# EAGLE design T04_Display (EAGLE 6.3)
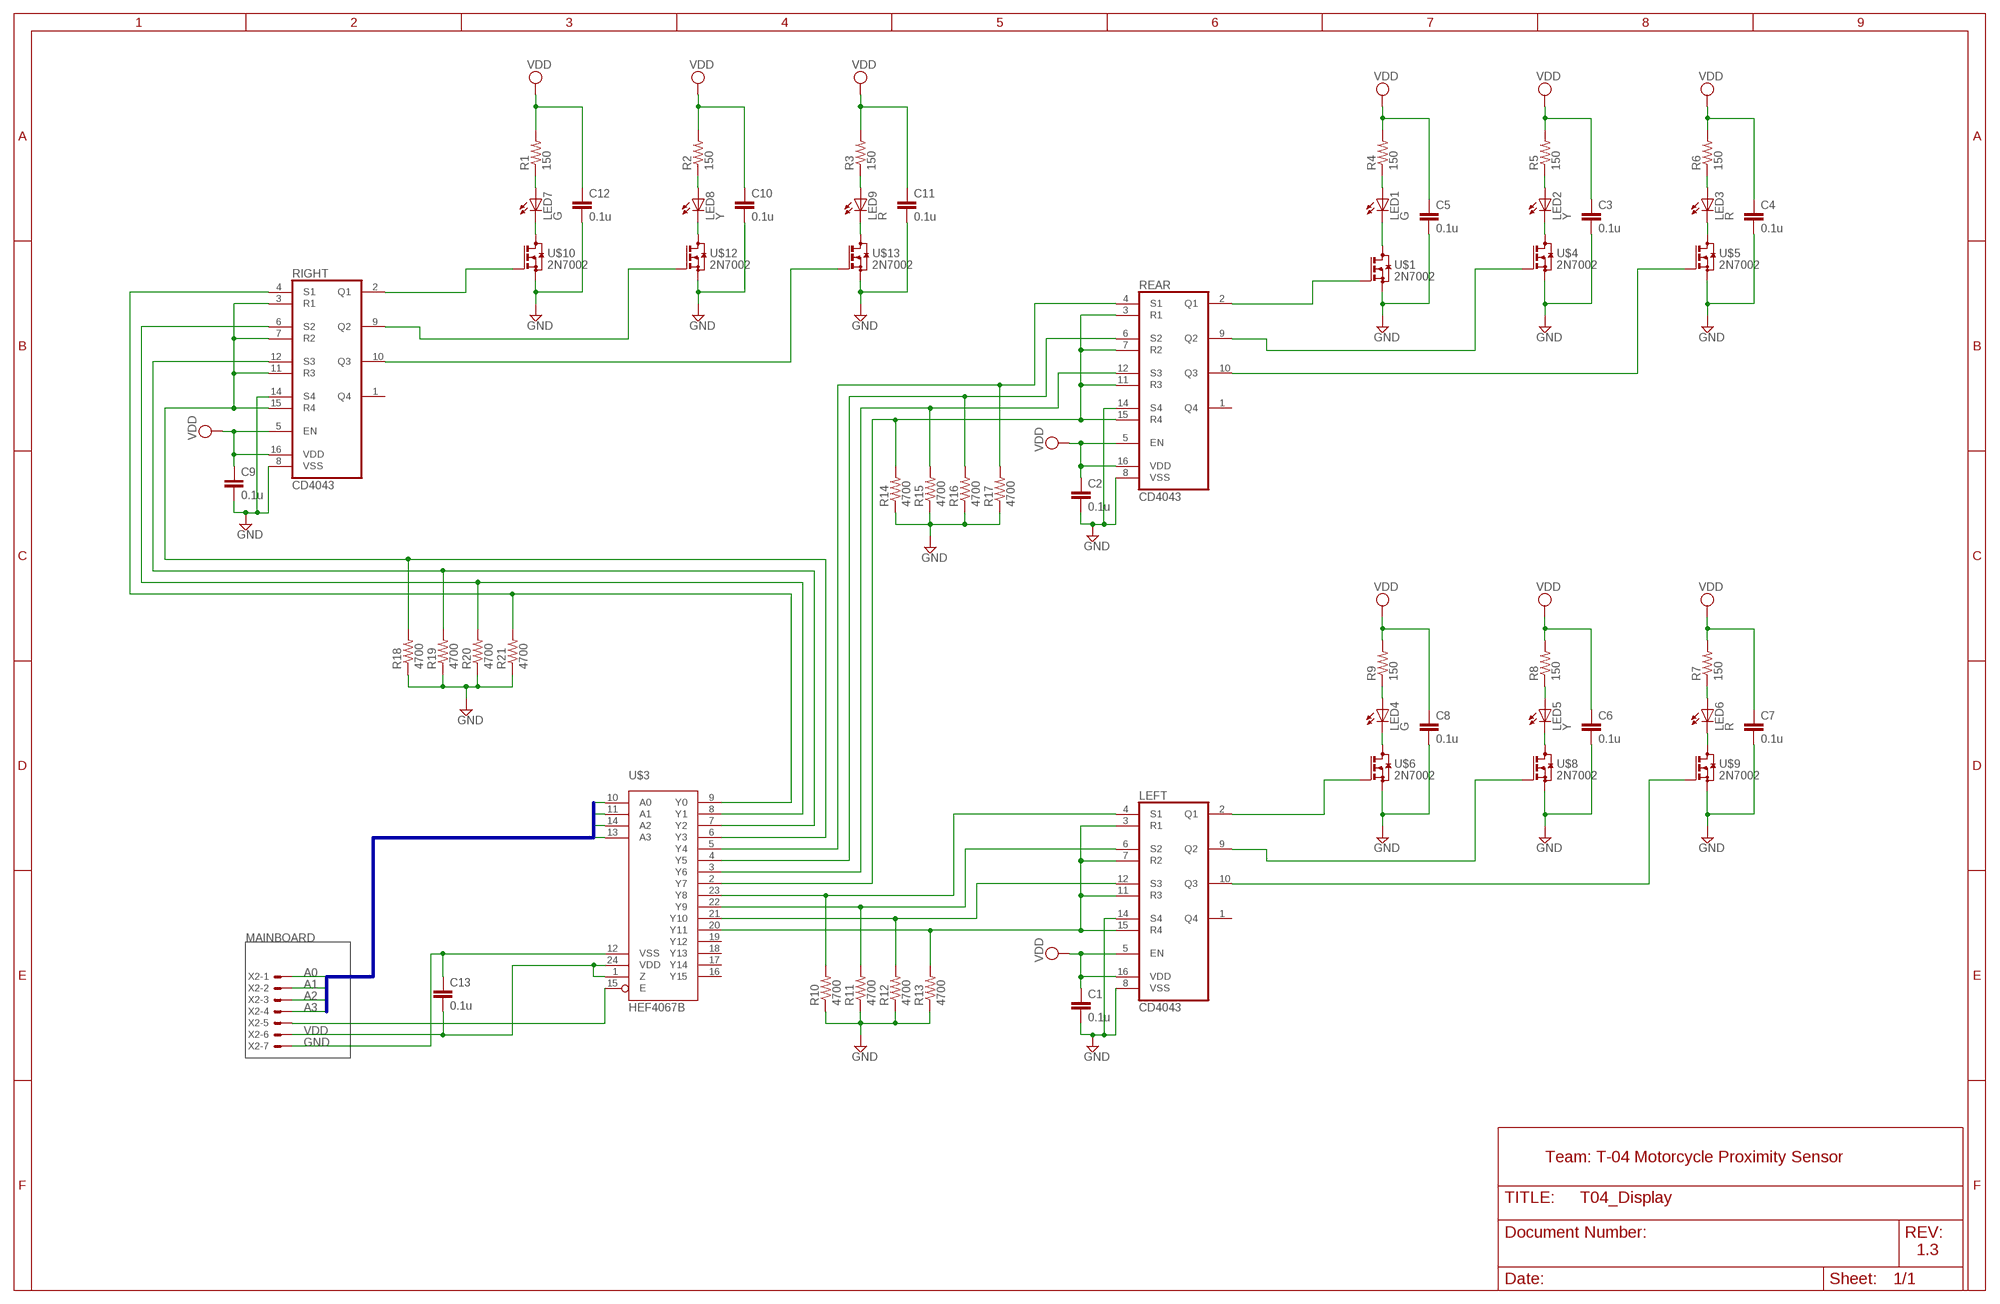
[diagram p0: schematic, sheet 1]

## Parts
C1  0.1u  C-EUC1206  [C1206]
C2  0.1u  C-EUC1206  [C1206]
C3  0.1u  C-EUC1206  [C1206]
C4  0.1u  C-EUC1206  [C1206]
C5  0.1u  C-EUC1206  [C1206]
C6  0.1u  C-EUC1206  [C1206]
C7  0.1u  C-EUC1206  [C1206]
C8  0.1u  C-EUC1206  [C1206]
C9  0.1u  C-EUC1206  [C1206]
C10  0.1u  C-EUC1206  [C1206]
C11  0.1u  C-EUC1206  [C1206]
C12  0.1u  C-EUC1206  [C1206]
C13  0.1u  C-EUC1206  [C1206]
LED1  G  LED3MM  [LED3MM]
LED2  Y  LED3MM  [LED3MM]
LED3  R  LED3MM  [LED3MM]
LED4  G  LED3MM  [LED3MM]
LED5  Y  LED3MM  [LED3MM]
LED6  R  LED3MM  [LED3MM]
LED7  G  LED3MM  [LED3MM]
LED8  Y  LED3MM  [LED3MM]
LED9  R  LED3MM  [LED3MM]
LEFT  CD4043  [SOIC16N]
R1  150  R-US_R1206  [R1206]
R2  150  R-US_R1206  [R1206]
R3  150  R-US_R1206  [R1206]
R4  150  R-US_R1206  [R1206]
R5  150  R-US_R1206  [R1206]
R6  150  R-US_R1206  [R1206]
R7  150  R-US_R1206  [R1206]
R8  150  R-US_R1206  [R1206]
R9  150  R-US_R1206  [R1206]
R10  4700  R-US_R1206  [R1206]
R11  4700  R-US_R1206  [R1206]
R12  4700  R-US_R1206  [R1206]
R13  4700  R-US_R1206  [R1206]
R14  4700  R-US_R1206  [R1206]
R15  4700  R-US_R1206  [R1206]
R16  4700  R-US_R1206  [R1206]
R17  4700  R-US_R1206  [R1206]
R18  4700  R-US_R1206  [R1206]
R19  4700  R-US_R1206  [R1206]
R20  4700  R-US_R1206  [R1206]
R21  4700  R-US_R1206  [R1206]
REAR  CD4043  [SOIC16N]
RIGHT  CD4043  [SOIC16N]
U$1  2N7002  [SOT23]
U$3  HEF4067B  [SO24W]
U$4  2N7002  [SOT23]
U$5  2N7002  [SOT23]
U$6  2N7002  [SOT23]
U$8  2N7002  [SOT23]
U$9  2N7002  [SOT23]
U$10  2N7002  [SOT23]
U$12  2N7002  [SOT23]
U$13  2N7002  [SOT23]
X2  22-23-2071  [22-23-2071]

## Nets
A0: U$3.10(A0) X2.1
A1: U$3.11(A1) X2.2
A2: U$3.14(A2) X2.3
A3: U$3.13(A3) X2.4
BG: RIGHT.2(Q1) U$10.1(G)
BR: RIGHT.10(Q3) U$13.1(G)
BRES: R18.2 RIGHT.3(R1) RIGHT.7(R2) RIGHT.11(R3) RIGHT.15(R4) U$3.6(Y3)
BS1: R21.2 RIGHT.4(S1) U$3.9(Y0)
BS2: R20.2 RIGHT.6(S2) U$3.8(Y1)
BS3: R19.2 RIGHT.12(S3) U$3.7(Y2)
BY: RIGHT.9(Q2) U$12.1(G)
GND: C1.2 C2.2 C3.2 C4.2 C5.2 C6.2 C7.2 C8.2 C9.2 C10.2 C11.2 C12.2 C13.1 LEFT.8(VSS) LEFT.14(S4) R10.1 R11.1 R12.1 R13.1 R14.1 R15.1 R16.1 R17.1 R18.1 R19.1 R20.1 R21.1 REAR.8(VSS) REAR.14(S4) RIGHT.8(VSS) RIGHT.14(S4) U$1.2(S) U$3.12(VSS) U$4.2(S) U$5.2(S) U$6.2(S) U$8.2(S) U$9.2(S) U$10.2(S) U$12.2(S) U$13.2(S) X2.7
LG: REAR.2(Q1) U$1.1(G)
LR: REAR.10(Q3) U$5.1(G)
LRES: R14.2 REAR.3(R1) REAR.7(R2) REAR.11(R3) REAR.15(R4) U$3.2(Y7)
LS1: R17.2 REAR.4(S1) U$3.5(Y4)
LS2: R16.2 REAR.6(S2) U$3.4(Y5)
LS3: R15.2 REAR.12(S3) U$3.3(Y6)
LY: REAR.9(Q2) U$4.1(G)
N$1: LED3.K(C) U$5.3(D)
N$3: LED2.K(C) U$4.3(D)
N$4: LED1.K(C) U$1.3(D)
N$5: LED1.A R4.1
N$6: LED3.A R6.1
N$7: U$3.15(E) X2.5
N$8: LED4.A R9.1
N$9: LED5.A R8.1
N$10: LED2.A R5.1
N$12: LED6.A R7.1
N$13: LED7.K(C) U$10.3(D)
N$14: LED7.A R1.1
N$15: LED8.K(C) U$12.3(D)
N$16: LED8.A R2.1
N$17: LED9.K(C) U$13.3(D)
N$18: LED9.A R3.1
N$21: LED6.K(C) U$9.3(D)
N$22: LED4.K(C) U$6.3(D)
N$23: LED5.K(C) U$8.3(D)
RG: LEFT.2(Q1) U$6.1(G)
RR: LEFT.10(Q3) U$9.1(G)
RRES: LEFT.3(R1) LEFT.7(R2) LEFT.11(R3) LEFT.15(R4) R13.2 U$3.20(Y11)
RS1: LEFT.4(S1) R10.2 U$3.23(Y8)
RS2: LEFT.6(S2) R11.2 U$3.22(Y9)
RS3: LEFT.12(S3) R12.2 U$3.21(Y10)
RY: LEFT.9(Q2) U$8.1(G)
VDD: C1.1 C2.1 C3.1 C4.1 C5.1 C6.1 C7.1 C8.1 C9.1 C10.1 C11.1 C12.1 C13.2 LEFT.5(EN) LEFT.16(VDD) R1.2 R2.2 R3.2 R4.2 R5.2 R6.2 R7.2 R8.2 R9.2 REAR.5(EN) REAR.16(VDD) RIGHT.5(EN) RIGHT.16(VDD) U$3.1(Z) U$3.24(VDD) X2.6
Unconnected: LEFT.1(Q4) REAR.1(Q4) RIGHT.1(Q4) U$3.16(Y15) U$3.17(Y14) U$3.18(Y13) U$3.19(Y12)

## Buses
A0,A1,A2,A3

## Notes on the sheet
- MAINBOARD
- Team: T-04 Motorcycle Proximity Sensor
- 1.3

## Library data of the parts
C1-C13 = resistor:C-EU: CAPACITOR, European symbol; SPICEPREFIX: C
LED1-LED9 = display:LED: LED OSRAM: - CHIPLED LG R971, LG N971, LY N971, LG Q971, LY Q971, LO R971, LY R971 LH N974, LH R974 LS Q976, LO Q976, LY Q976 LO Q996 - Hyper CHIPLED LW Q18S LB Q993, LB Q99A, LB R99A - SideLED LS A670, LO A670, LY A670, LG A670, LP A670 LB A673, LV A673, LT A673, LW A673 LH A674 LY A675 LS A676, LA A676, LO A676, LY A676, LW A676 LS A679, LY A679, LG A679 - Hyper Micro SIDELED® LS Y876, LA Y876, LO Y876, LY Y876 LT Y87S - SmartLED LW L88C, LW L88S LB L89C, LB L89S, LG L890 LS L89K, LO L89K, LY L89K LS L896, LA L896, LO L896, LY L896 - TOPLED LS T670, LO T670, LY T670, LG T670, LP T670 LSG T670, LSP T670, LSY T670, LOP T670, LYG T670 LG T671, LOG T671, LSG T671 LB T673, LV T673, LT T673, LW T673 LH T674 LS T676, LA T676, LO T676, LY T676, LB T676, LH T676, LSB T676, LW T676 LB T67C, LV T67C, LT T67C, LS T67K, LO T67K, LY T67K, LW E67C LS E67B, LA E67B, LO E67B, LY E67B, LB E67C, LV E67C, LT E67C LW T67C LS T679, LY T679, LG T679 LS T770, LO T770, LY T770, LG T770, LP T770 LB T773, LV T773, LT T773, LW T773 LH T774 LS E675, LA E675, LY E675, LS T675 LS T776, LA T776, LO T776, LY T776, LB T776 LHGB T686 LT T68C, LB T68C - Hyper Mini TOPLED® LB M676 - Mini TOPLED Santana® LG M470 LS M47K, LO M47K, LY M47K Source: http://www.osram.convergy.de LUXEON: - LUMILED® LXK2-PW12-R00, LXK2-PW12-S00, LXK2-PW14-U00, LXK2-PW14-V00 LXK2-PM12-R00, LXK2-PM12-S00, LXK2-PM14-U00 LXK2-PE12-Q00, LXK2-PE12-R00, LXK2-PE12-S00, LXK2-PE14-T00, LXK2-PE14-U00 LXK2-PB12-K00, LXK2-PB12-L00, LXK2-PB12-M00, LXK2-PB14-N00, LXK2-PB14-P00, LXK2-PB14-Q00 LXK2-PR12-L00, LXK2-PR12-M00, LXK2-PR14-Q00, LXK2-PR14-R00 LXK2-PD12-Q00, LXK2-PD12-R00, LXK2-PD12-S00 LXK2-PH12-R00, LXK2-PH12-S00 LXK2-PL12-P00, LXK2-PL12-Q00, LXK2-PL12-R00 Source: www.luxeon.com KINGBRIGHT: KA-3528ASYC Source: www.kingbright.com
LEFT REAR RIGHT = display:CD4043
R1-R21 = rcl:R-US_: RESISTOR, American symbol
U$1 U$4-U$6 U$8-U$10 U$12 U$13 = display:2N7002: 2N7002 nMOS
U$3 = display:HEF4067B
X2 = con-molex:22-23-2071: .100" (2.54mm) Center Header - 7 Pin; MF: MOLEX; MPN: 22-23-2071; OC_FARNELL: 1654534; OC_NEWARK: 56H0445

## Board
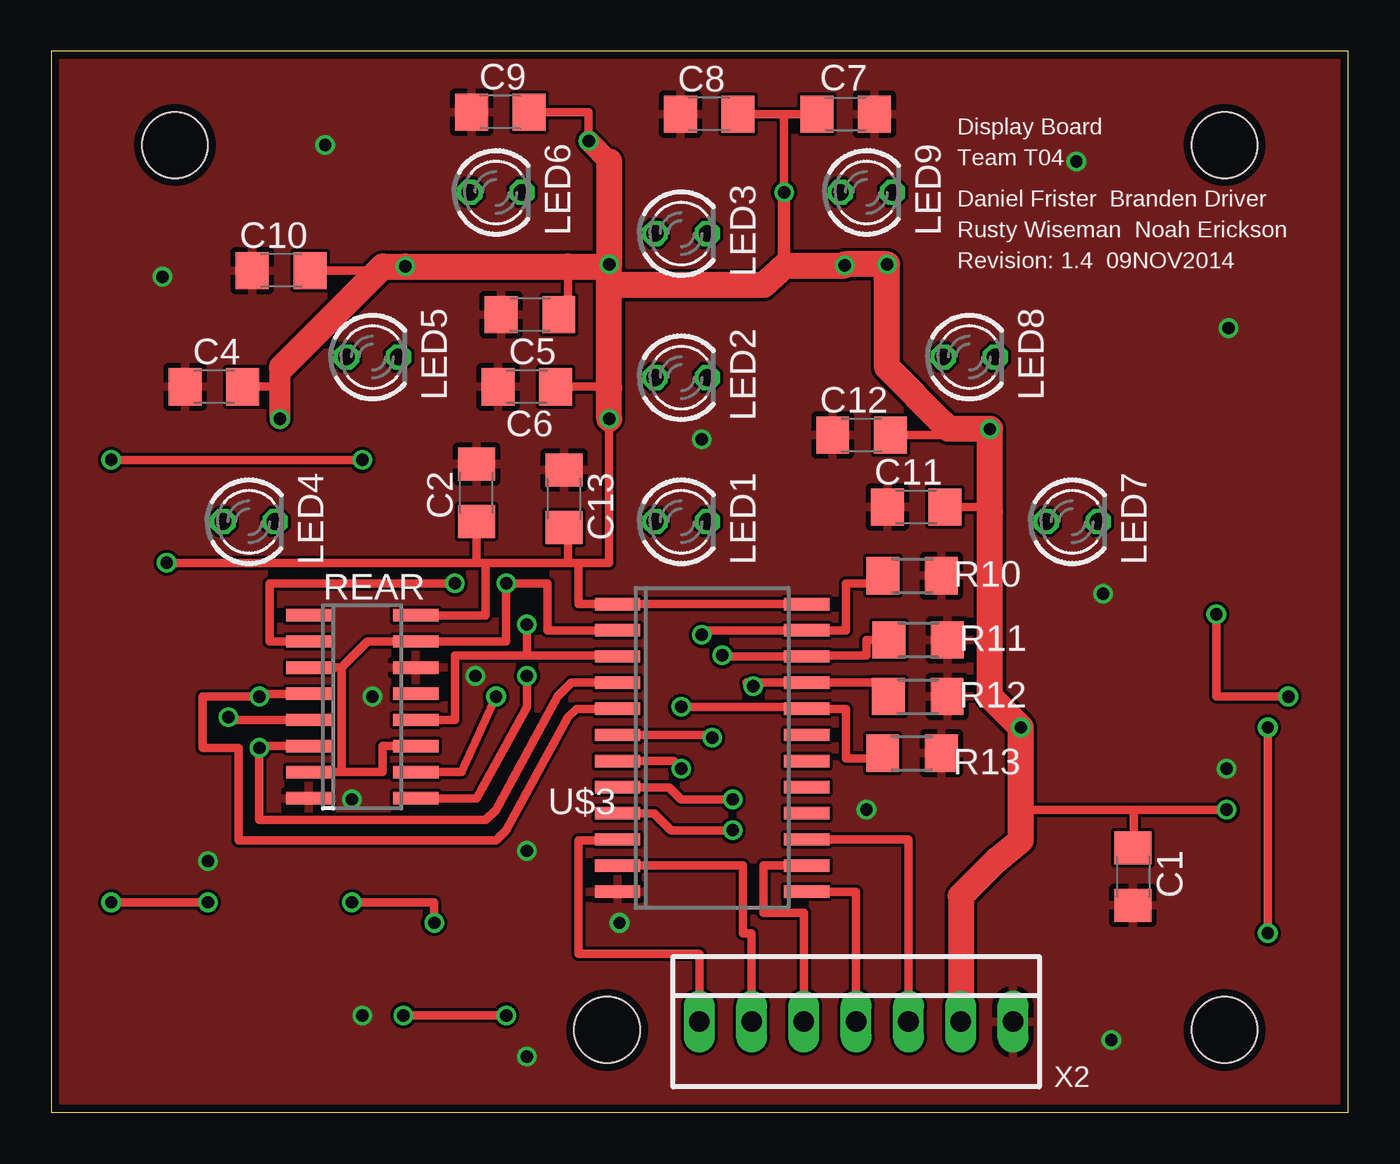
[diagram p1: board, top side]
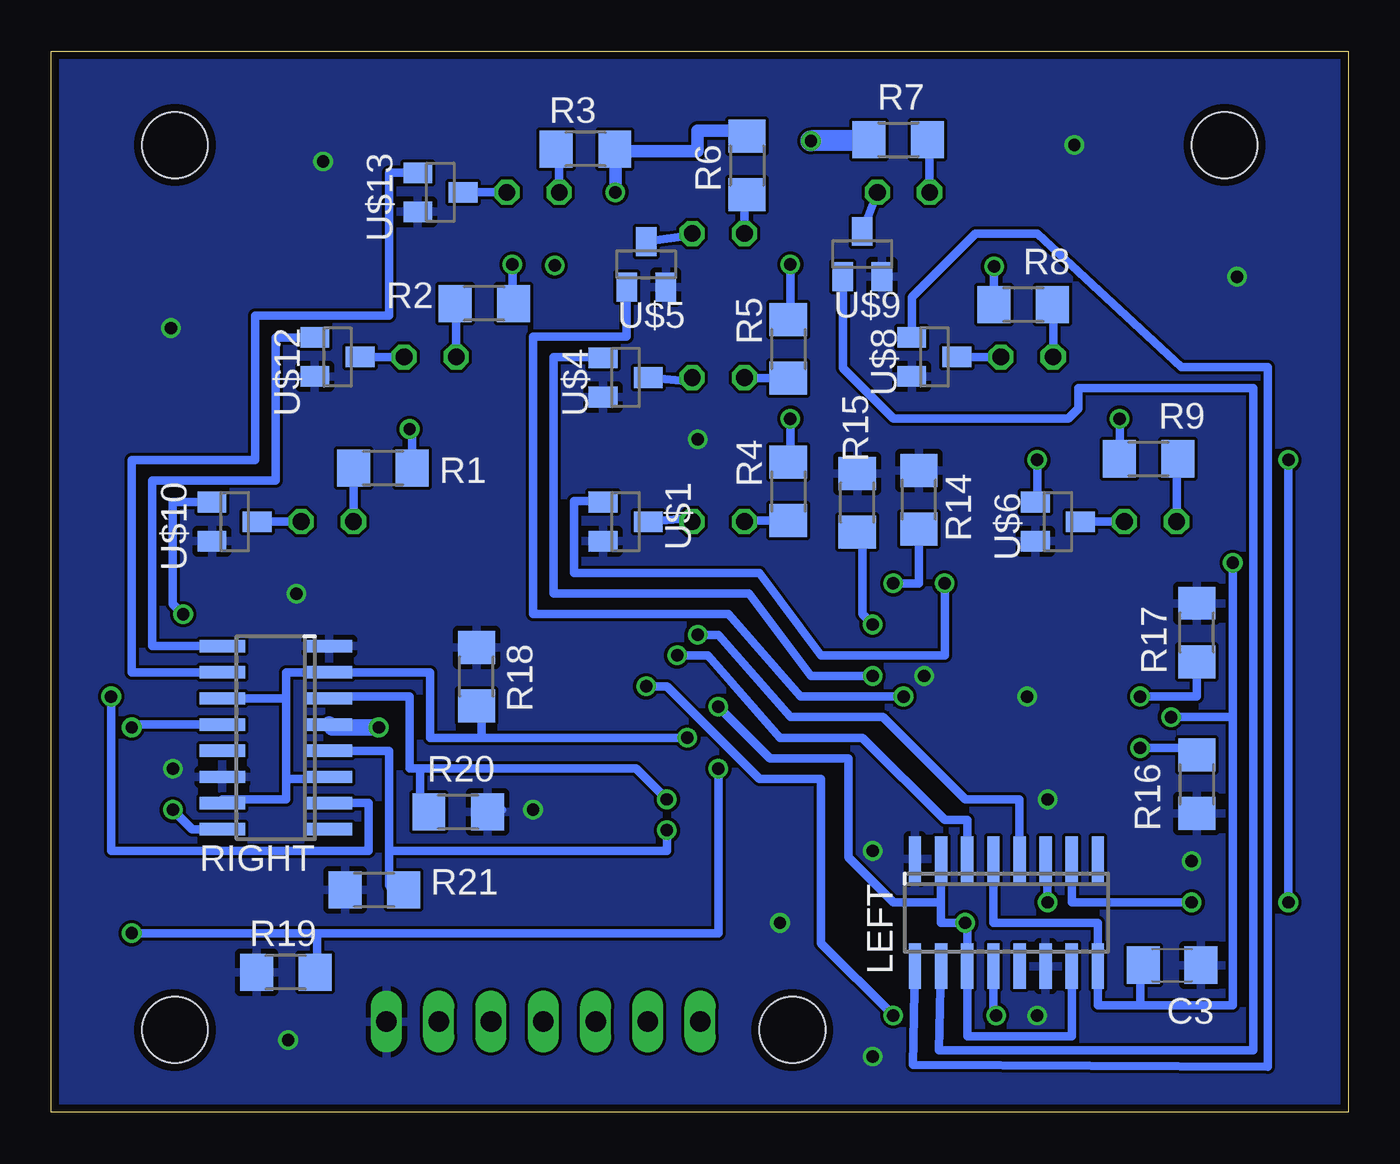
[diagram p2: board, bottom side, seen from below]

Size 63 x 51.55 mm. Coordinates in mm from the lower left corner, seen from the top.
Outline: 0,0 63,0 63,51.55 0,51.55 0,0
Copper layers (1*16): Top 0.0356mm / dielectric 1.5011mm / Bottom 0.0356mm
Design rules "OSH-Park-2-layer": minimum track width 6mil, minimum drill 13mil, track to track 6mil, track to pad 6mil, pad to pad 6mil, via to via 6mil, smd to smd 6mil, copper to edge 15mil, drill to drill 6mil, minimum pad ring 7mil, minimum via ring 7mil, stop-mask expansion 3mil, vias tented up to drill 0mil, thermal gap 10mil
Holes 3.2 mm at 27,4 57,4 57,47 6,47

### Footprints (pad centres in the part's own frame; a part is rotated, then mirrored left to right if it is on the bottom)
C1206 = smd 1.6 x 1.8: 1 -1.4,0; 2 1.4,0
LED3MM = drill 0.813 octagon: A -1.27,0; K 1.27,0
SOIC16N = smd 0.6 x 2.2: 1 -4.445,-2.6; 2 -3.175,-2.6; 3 -1.905,-2.6; 4 -0.635,-2.6; 5 0.635,-2.6; 6 1.905,-2.6; 7 3.175,-2.6; 8 4.445,-2.6; 9 4.445,2.6; 10 3.175,2.6; 11 1.905,2.6; 12 0.635,2.6; 13 -0.635,2.6; 14 -1.905,2.6; 15 -3.175,2.6; 16 -4.445,2.6
R1206 = smd 1.6 x 1.803: 1 -1.422,0; 2 1.422,0
SOT23 = smd 1 x 1.4: 1 -0.95,-1.1; 2 0.95,-1.1; 3 0,1.1
SO24W = smd 0.6 x 2.2: 1 -6.985,-4.6; 2 -5.715,-4.6; 3 -4.445,-4.6; 4 -3.175,-4.6; 5 -1.905,-4.6; 6 -0.635,-4.6; 7 0.635,-4.6; 8 1.905,-4.6; 9 3.175,-4.6; 10 4.445,-4.6; 11 5.715,-4.6; 12 6.985,-4.6; 13 6.985,4.6; 14 5.715,4.6; 15 4.445,4.6; 16 3.175,4.6; 17 1.905,4.6; 18 0.635,4.6; 19 -0.635,4.6; 20 -1.905,4.6; 21 -3.175,4.6; 22 -4.445,4.6; 23 -5.715,4.6; 24 -6.985,4.6
22-23-2071 = drill 1 long: 1 -7.62,0; 2 -5.08,0; 3 -2.54,0; 4 0,0; 5 2.54,0; 6 5.08,0; 7 7.62,0

### Placement (x,y rotation side)
C1  52.55,11.45 270 top
C2  20.65,30.1 90 top
C3  8.55,7.15 0 bottom
C4  7.9,35.25 180 top
C5  23.25,38.75 180 top
C6  23.1,35.25 180 top
C7  38.59,48.5 0 top
C8  31.96,48.5 180 top
C9  21.81,48.6 180 top
C10  11.16,40.9 180 top
C11  42.01,29.4 180 top
C12  39.36,32.9 180 top
C13  1u  [C1206]  24.9,29.81 270 top
LED1  30.6,28.7 0 top
LED2  30.6,35.7 0 top
LED3  30.6,42.7 0 top
LED4  9.6,28.7 0 top
LED5  15.6,36.7 0 top
LED6  21.6,44.7 0 top
LED7  49.6,28.7 0 top
LED8  44.6,36.7 0 top
LED9  39.6,44.7 0 top
LEFT  16.6,9.7 180 bottom
R1  46.89,31.3 0 bottom
R2  41.97,39.3 0 bottom
R3  37.05,46.8 0 bottom
R4  27.2,30.17 90 bottom
R5  27.2,37.09 90 bottom
R6  29.2,46.01 90 bottom
R7  21.86,47.25 180 bottom
R8  15.78,39.25 180 bottom
R9  9.7,31.75 180 bottom
R10  41.83,26.07 180 top
R11  42.11,22.95 180 top
R12  42.1,20.2 180 top
R13  41.81,17.45 180 top
R14  20.85,29.76 270 bottom
R15  23.85,29.61 270 bottom
R16  7.35,15.94 90 bottom
R17  7.35,23.31 270 bottom
R18  42.35,21.16 270 bottom
R19  51.61,6.8 0 bottom
R20  43.24,14.6 180 bottom
R21  47.31,10.8 0 bottom
REAR  15.1,19.7 270 top
RIGHT  52.1,18.2 90 bottom
U$1  35.1,28.7 270 bottom
U$3  32.1,17.7 270 top
U$4  35.1,35.7 270 bottom
U$5  34.1,41.2 0 bottom
U$6  14.1,28.7 270 bottom
U$8  20.1,36.7 270 bottom
U$9  23.6,41.7 0 bottom
U$10  54.1,28.7 270 bottom
U$12  49.1,36.7 270 bottom
U$13  44.1,44.7 270 bottom
X2  39.1,4.4 0 top

### Tracks (layer width: path | path; a pad name or v marks a point on that pad's centre or on a via)
A0
  Top 0.406: U$3.10 27.5,13.2 25.6,13.2 25.6,7.7 31.48,7.7 X2.1
A1
  Top 0.406: U$3.11 33.6,11.98 33.6,8.7 34.02,8.7 X2.2
A2
  Top 0.406: U$3.14 34.6,11.98 34.6,9.7 36.56,9.7 X2.3
A3
  Top 0.406: U$3.13 39.1,10.71 X2.4
BG  (via drill 0.6)
  Top 0.406: v56.6,24.2 56.6,20.2 v60.1,20.2
  Bottom 0.406: U$10.1 57.1,29.65 57.1,24.7 v56.6,24.2 | RIGHT.2 47.6,15.03 47.6,12.7 60.1,12.7 v60.1,20.2
BR
  Bottom 0.406: U$13.1 46.6,45.65 46.6,38.7 53.1,38.7 53.1,31.7 59.1,31.7 59.1,21.38 RIGHT.10
BRES  (via drill 0.6)
  Top 0.406: U$3.6 31.96,18.34 v32.1,18.2
  Bottom 0.406: RIGHT.11 51.6,20.11 | 51.6,20.11 51.6,21.38 RIGHT.7 44.6,21.38 44.6,18.2 42.1,18.2 | RIGHT.3 49.5,16.2 51.6,16.2 | 51.6,16.2 51.6,20.11 | RIGHT.15 54.7,15.2 51.6,15.2 51.6,16.2 | v32.1,18.2 42.1,18.2 | R18.2 42.1,19.49 42.1,18.2
BS1  (via drill 0.6)
  Top 0.406: U$3.9 29.27,14.53 30.1,13.7 v33.1,13.7
  Bottom 0.406: v33.1,13.7 33.1,12.7 46.6,12.7 | 46.6,12.7 46.6,17.57 RIGHT.4 | R21.2 arc90 46.6,11.01 46.6,12.7
BS2  (via drill 0.6)
  Top 0.406: U$3.8 30,15.79 30.6,15.2 v33.1,15.2
  Bottom 0.406: RIGHT.6 49.5,20.2 45.6,20.2 45.6,16.7 45.1,16.7 | v33.1,15.2 34.6,16.7 45.1,16.7 | R20.2 45.1,15.04 45.1,16.7
BS3  (via drill 0.6)
  Top 0.406: U$3.7 30.23,17.07 v30.6,16.7 | v59.1,8.7 v59.1,18.7
  Bottom 0.406: v30.6,16.7 30.6,8.7 50.1,8.7 | 50.1,8.7 v59.1,8.7 | R19.2 arc-90 50.1,6.89 50.1,8.7 | RIGHT.12 58.97,18.84 v59.1,18.7
BY
  Bottom 0.406: U$12.1 52.1,37.65 52.1,30.7 58.1,30.7 58.1,22.64 RIGHT.9
GND  (via drill 0.6)
  Bottom 0.406: R20.1 41.42,14.7 | 41.42,14.7 41.6,14.7 | 41.42,14.7 41.1,14.7
  other vias: 39.6,14.7 27.6,9.2 23.1,12.7 15.1,4.7 20.6,21.2 15.6,20.2 57.1,16.7 7.6,12.2 14.6,15.2 5.4,40.6 13.3,47 49.8,46.2 57.2,38.1 23.1,2.7 31.6,32.7 51.1,25.2 51.5,3.5
  pour Bottom (isolate 0.01): 0,0 0.1,51.51 63.13,51.51 63.03,0
  pour Top (isolate 0.01): 0,0 0.19,51.5 63.23,51.51 63.03,0
LG  (via drill 0.6)
  Top 0.406: v19.6,25.7 10.6,25.7 10.6,22.88 REAR.2
  Bottom 0.406: U$1.1 36.2,29.7 37.6,29.7 37.6,26.2 28.6,26.2 25.6,22.2 19.6,22.2 v19.6,25.7
LR  (via drill 0.6)
  Top 0.406: REAR.10 19.93,16.52 v21.6,20.2
  Bottom 0.406: U$5.1 35.05,37.7 39.6,37.7 39.6,24.2 30.1,24.2 26.6,20.2 v21.6,20.2
LRES  (via drill 0.6)
  Top 0.406: REAR.11 16.1,17.8 16.1,16.52 14.1,16.52 | 14.1,16.52 REAR.7 | REAR.3 14.1,21.61 | 14.1,21.61 14.1,16.52 | 14.1,21.61 15.37,22.88 REAR.15 22.1,22.88 v22.1,25.7 24.1,25.7 24.1,23.41 U$3.2
  Bottom 0.406: v22.1,25.7 20.85,25.7 R14.2
LS1  (via drill 0.6)
  Top 0.406: REAR.4 10.1,20.34 v10.1,20.2 7.35,20.2 7.35,17.7 9.1,17.7 9.1,13.2 21.6,13.2 22.1,13.7 25.1,19.2 25.5,19.61 U$3.5
  Bottom 0.406: R17.2 7.35,20.2 v10.1,20.2
LS2  (via drill 0.6)
  Top 0.406: REAR.6 10.1,17.8 v10.1,17.7 10.1,14.2 21.1,14.2 21.6,14.7 24.6,20.2 25.27,20.88 U$3.4
  Bottom 0.406: R16.2 7.35,17.7 v10.1,17.7
LS3  (via drill 0.6)
  Top 0.406: U$3.3 27.45,22.2 23.1,22.2 | 23.1,22.2 19.6,22.2 19.6,19.07 REAR.12 | v23.1,23.7 23.1,22.2
  Bottom 0.406: R15.2 23.6,27.69 23.6,24.2 v23.1,23.7
LY  (via drill 0.6)
  Top 0.406: v23.1,21.2 23.1,19.7 20.66,15.26 REAR.9
  Bottom 0.406: U$4.1 36.2,36.7 38.6,36.7 38.6,25.2 29.1,25.2 26.1,21.2 v23.1,21.2
N$1
  Bottom 0.406: U$5.3 31.87,42.62 LED3.K
N$3
  Bottom 0.406: U$4.3 31.87,35.5 LED2.K
N$4
  Bottom 0.406: U$1.3 31.87,28.88 LED1.K
N$5
  Bottom 0.406: R4.1 29.33,28.75 LED1.A
N$6
  Bottom 0.406: R6.1 29.33,44.59 LED3.A
N$7
  Top 0.406: U$3.15 41.64,13.26 X2.5
N$8
  Bottom 0.406: R9.1 8.33,31.75 LED4.A
N$9
  Bottom 0.406: R8.1 14.33,39.25 LED5.A
N$10
  Bottom 0.406: R5.1 29.33,35.67 LED2.A
N$12
  Bottom 0.406: R7.1 20.33,47.25 LED6.A
N$13
  Bottom 0.406: U$10.3 LED7.K
N$14
  Bottom 0.406: R1.1 48.33,31.3 LED7.A
N$15
  Bottom 0.406: U$12.3 LED8.K
N$16
  Bottom 0.406: R2.1 43.33,39.3 LED8.A
N$17
  Bottom 0.406: U$13.3 LED9.K
N$18
  Bottom 0.406: R3.1 38.33,46.8 LED9.A
N$21
  Bottom 0.406: U$9.3 LED6.K
N$22
  Bottom 0.406: U$6.3 LED4.K
N$23
  Bottom 0.406: U$8.3 LED5.K
RG  (via drill 0.6)
  Top 0.406: v7.6,10.2 v2.9,10.2 | v2.9,31.7 v15.1,31.7
  Bottom 0.406: LEFT.2 13.43,10.2 v7.6,10.2 | v2.9,10.2 v2.9,31.7 | v15.1,31.7 15.1,29.65 U$6.1
RR
  Bottom 0.406: U$9.1 24.55,36.15 22.1,33.7 13.6,33.7 13.1,34.2 13.1,35.2 4.6,35.2 4.6,3 19.88,3 LEFT.10
RRES  (via drill 0.6)
  Top 0.406: R13.2 40.39,17.2 38.6,17.2 38.6,19.61 U$3.20 36.7,19.7 v30.6,19.7 | v14.6,10.2 18.6,10.2 v18.6,9.2
  Bottom 0.406: v30.6,19.7 28.1,17.2 24.27,17.2 24.27,12.38 22.1,10.2 19.77,10.2 | LEFT.15 13.43,3.7 18.5,3.7 LEFT.11 18.5,9.2 v18.6,9.2 19.77,9.2 19.77,10.2 | 19.77,10.2 LEFT.7 | LEFT.3 14.6,12.3 v14.6,10.2
RS1  (via drill 0.6)
  Top 0.406: R10.2 40.41,25.7 38.6,25.7 38.6,23.41 U$3.23 31.6,23.41 v31.6,23.2
  Bottom 0.406: v31.6,23.2 30.6,23.2 27.1,19.2 22.6,19.2 18.6,15.2 15.96,15.2 LEFT.4
RS2  (via drill 0.6)
  Top 0.406: R11.2 39.6,22.95 39.6,22.2 36.7,22.2 U$3.22 32.66,22.14 v32.6,22.2
  Bottom 0.406: v32.6,22.2 31.1,22.2 27.6,18.2 23.6,18.2 19.6,14.2 18.5,14.2 LEFT.6
RS3  (via drill 0.6)
  Top 0.406: R12.2 40.68,20.88 U$3.21 33.77,20.88 v34.1,20.7 | v22.1,4.7 v17.1,4.7
  Bottom 0.406: v34.1,20.7 33.1,20.7 28.6,16.2 25.6,16.2 25.6,8.2 v22.1,4.7 | LEFT.12 17.23,4.83 v17.1,4.7
RY
  Bottom 0.406: U$8.1 21.2,39.6 18.1,42.7 15.1,42.7 8.1,36.2 3.9,36.2 3.9,2.2 21.14,2.3 LEFT.9
VDD  (via drill 0.6)
  Top 0.406: 29.6,24.7 36.69,24.7 U$3.24 U$3.1 27.48,24.7 25.6,24.7 25.6,26.7 | v57.1,14.7 52.6,14.7 | 52.6,14.7 47.1,14.7 | 25.6,26.7 27.1,26.7 v27.1,33.7 | REAR.16 21.1,24.14 21.1,26.7 | 21.1,26.7 25.1,26.7 | 25.1,26.7 25.6,26.7 | v5.6,26.7 20.6,26.7 | 20.6,26.7 21.1,26.7 | REAR.5 8.6,19.07 v8.6,19.2 | C2.1 20.65,26.75 20.6,26.7 | C13.2 25.1,28.21 25.1,26.7 | C1.1 52.6,12.9 52.6,14.7 | C9.1 26.1,48.6 v26.1,47.2 | C8.1 35.6,48.5 | 35.6,48.5 v35.6,44.7 | C7.1 35.6,48.5 | C6.1 27.1,35.25 27.1,35.2 | C12.1 43.35,32.9 43.35,33.45 | C11.1 45.6,29.4 45.6,29.2 | C4.1 11.1,35.25 11.1,35.2 | C10.1 15.9,40.9 | C5.1 25.1,38.75 25.1,41.1 | 27.2,40.2 27.1,40.2 v27.1,41.2
  Top 0.61: v35.6,44.7 35.6,41.2
  Top 1.016: v11.1,33.7 11.1,35.2 11.1,36.2 11.2,36.2 | v26.1,47.2 27.1,46.2 | v17.2,41.1 17.3,41.2 | 43.6,33.2 43.35,33.45 | 35.65,41.15 35.6,41.2 | 38.55,41.2 v38.55,41.15 | 16.1,41.1 16.1,41.2 | 27,41.1 v27.1,41.2 | 46.01,12.31 45.98,12.31
  Top 1.27: 27.1,46.2 v27.1,41.2 27.1,35.2 v27.1,33.7 | 46.01,12.31 47.1,13.2 47.1,14.7 v47.1,18.7 45.6,20.2 45.6,29.2 v45.6,33.2 43.6,33.2 | 43.35,33.45 40.6,36.2 v40.6,41.2 38.55,41.2 | 27.2,40.2 34.6,40.2 35.65,41.15 v38.55,41.15 | 11.2,36.2 15.9,40.9 16.1,41.1 v17.2,41.1 25.1,41.1 27,41.1 | X2.6 44.18,10.51 45.98,12.31
  Bottom 0.406: 29.2,47.7 R6.2 | R1.2 45.47,33.07 v45.6,33.2 | LEFT.5 17.23,9.2 12.15,9.2 LEFT.16 12.15,5.2 10.1,5.2 | RIGHT.16 56.16,13.76 v57.1,14.7 | R9.2 11.1,31.77 v11.1,33.7 | 27.2,41.1 v27.1,41.2 27.1,38.51 R5.2 | R4.2 27.1,31.69 v27.1,33.7 | v5.6,26.7 5.6,19.2 | 5.6,19.2 5.6,5.2 10.1,5.2 | v8.6,19.2 5.6,19.2 | R2.2 40.6,39.3 v40.6,41.2 | R8.2 v17.2,41.1 | C3.1 10.1,7 10.1,5.2
  Bottom 0.61: 29.2,47.7 31.6,47.7 31.6,46.7 35.53,46.7 R3.2 35.6,46.77 v35.6,44.7
  Bottom 0.813: v47.1,18.7 49.37,18.7 RIGHT.5
  Bottom 1.016: R7.2 23.33,47.2 v26.1,47.2

### Text on the board
tNames: Display Board | Team T04 | Daniel Frister Branden Driver | Rusty Wiseman Noah Erickson | Revision: 1.4 09NOV2014